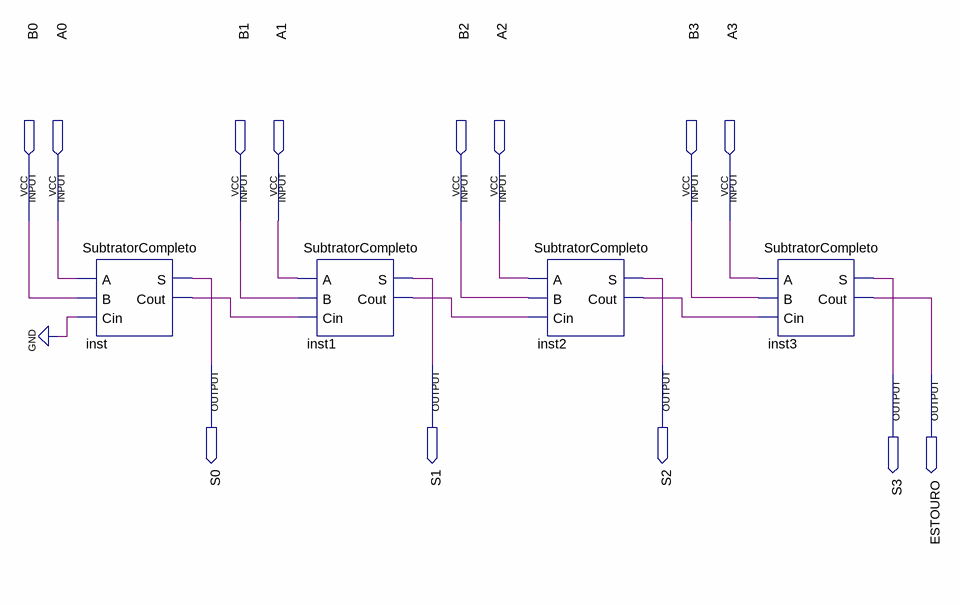
[diagram p0: schematic sheet]
// Quartus schematic Proj9_SubtratorCompleto.bdf as structural Verilog: 4 symbols, 13 pins
module Proj9_SubtratorCompleto (
  input  B0,
  input  A0,
  input  B1,
  input  A1,
  input  B2,
  input  A2,
  input  B3,
  input  A3,
  output S0,
  output S1,
  output S2,
  output S3,
  output ESTOURO
);

  wire inst1_cout, inst2_cout, inst_cout;

  SubtratorCompleto inst (.A(A0), .B(B0), .Cin(1'b0), .S(S0), .Cout(inst_cout));
  SubtratorCompleto inst1 (.A(A1), .B(B1), .Cin(inst_cout), .S(S1), .Cout(inst1_cout));
  SubtratorCompleto inst2 (.A(A2), .B(B2), .Cin(inst1_cout), .S(S2), .Cout(inst2_cout));
  SubtratorCompleto inst3 (.A(A3), .B(B3), .Cin(inst2_cout), .S(S3), .Cout(ESTOURO));
endmodule
